# Altium schematic sheet Part04_MT7688_Power.SchDoc
size A4
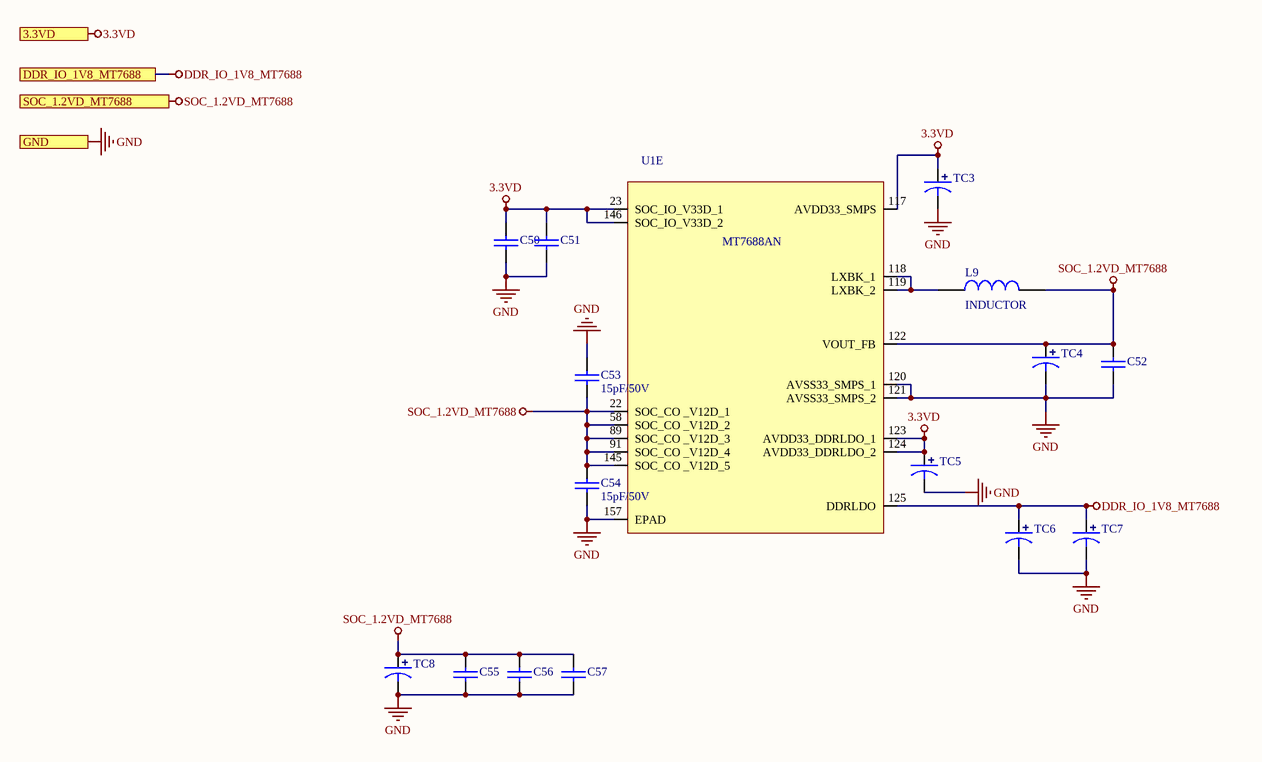
[diagram p0: Part04_MT7688_Power.SchDoc]

## Parts
C50  0.1uF/16V  [0402C]  (value not drawn)
C51  0.1uF/16V  [0402C]  (value not drawn)
C52  0.1uF/16V  [0402C]  (value not drawn)
C53  15pF/50V  [0402C]
C54  15pF/50V  [0402C]
C55  0.1uF/16V  [0402C]  (value not drawn)
C56  0.1uF/16V  [0402C]  (value not drawn)
C57  0.1uF/16V  [0402C]  (value not drawn)
L9  INDUCTOR  [CD31]
TC3  2.2uF/6.3V  [TAJ-A/3216]  (value not drawn)
TC4  10uF/6.3V  [TAJ-A/3216]  (value not drawn)
TC5  10uF/6.3V  [TAJ-A/3216]  (value not drawn)
TC6  2.2uF/6.3V  [TAJ-A/3216]  (value not drawn)
TC7  4.7uF/6.3V  [TAJ-A/3216]  (value not drawn)
TC8  4.7uF/6.3V  [TAJ-A/3216]  (value not drawn)
U1  MT7688AN  [MT7628AN$2F$DRQFN156$2F$SMD$2F$P0.5$2F$12X12]  (part E of 6)

## Ports
3.3VD, DDR_IO_1V8_MT7688, GND, SOC_1.2VD_MT7688

## Nets
3.3VD: C50.1 C51.1 TC3.1 TC5.1 U1.23(SOC_IO_V33D_1) U1.117(AVDD33_SMPS) U1.123(AVDD33_DDRLDO_1) U1.124(AVDD33_DDRLDO_2) U1.146(SOC_IO_V33D_2) ; port 3.3VD
DDR_IO_1V8_MT7688: TC6.1 TC7.1 U1.125(DDRLDO) ; port DDR_IO_1V8_MT7688
GND: C50.2 C51.2 C52.2 C53.1 C54.2 C55.2 C56.2 C57.2 TC3.2 TC4.2 TC5.2 TC6.2 TC7.2 TC8.2 U1.120(AVSS33_SMPS_1) U1.121(AVSS33_SMPS_2) U1.157(EPAD) ; port GND
SOC_1.2VD_MT7688: C52.1 C53.2 C54.1 C55.1 C56.1 C57.1 L9.2 TC4.1 TC8.1 U1.22(SOC_CO__V12D_1) U1.58(SOC_CO__V12D_2) U1.89(SOC_CO__V12D_3) U1.91(SOC_CO__V12D_4) U1.122(VOUT_FB) U1.145(SOC_CO__V12D_5) ; port SOC_1.2VD_MT7688
NetL9_1: L9.1 U1.118(LXBK_1) U1.119(LXBK_2)

## Library data of the parts
C50-C57 = CAP: 无极性电容
TC3-TC8 = TCAP: 钽电容